# EAGLE design stm32 (EAGLE 9.6.2)
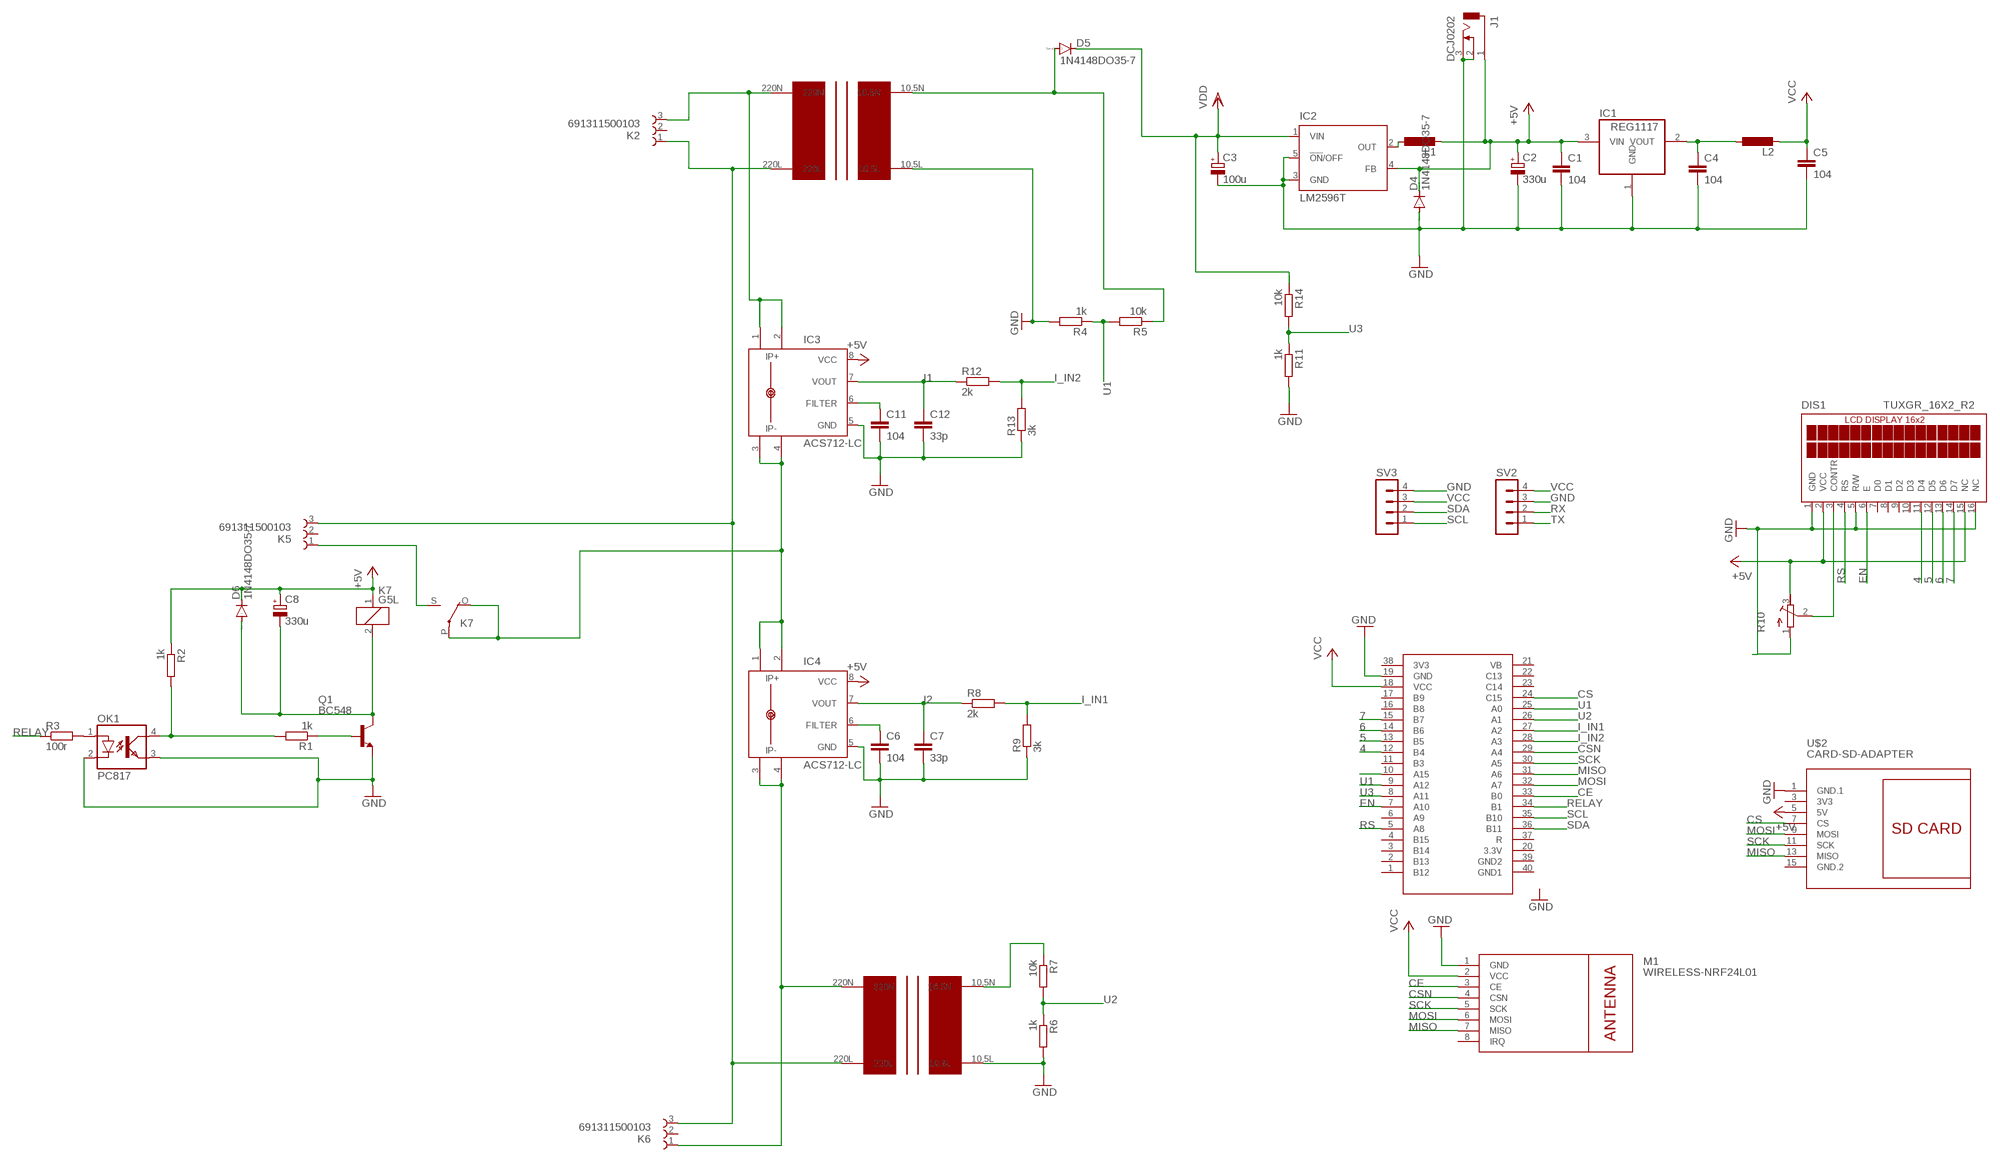
[diagram p0: schematic, sheet 1]

## Parts
C1  104  C-EU050-025X075  [C050-025X075]
C2  330u  CPOL-EUE2.5-7  [E2,5-7]
C3  100u  CPOL-EUE2.5-7  [E2,5-7]
C4  104  C-EU050-025X075  [C050-025X075]
C5  104  C-EU050-025X075  [C050-025X075]
C6  104  C-EU050-025X075  [C050-025X075]
C7  33p  C-EU050-025X075  [C050-025X075]
C8  330u  CPOL-EUE2.5-7  [E2,5-7]
C11  104  C-EU050-025X075  [C050-025X075]
C12  33p  C-EU050-025X075  [C050-025X075]
D4  1N4148DO35-7  [DO35-7]
D5  1N4148DO35-7  [DO35-7]
D6  1N4148DO35-7  [DO35-7]
DIS1  TUXGR_16X2_R2  [TUXGR_16X2_R2]
IC1  REG1117  [SOT223]
IC2  LM2596T  [T05D]
IC3  ACS712-LC  [SOIC8]
IC4  ACS712-LC  [SOIC8]
J1  DCJ0202  [DCJ0202]
K2  691311500103  [691311500103]
K5  691311500103  [691311500103]
K6  691311500103  [691311500103]
K7  G5L  [G5LE]
L1  L-EU6000-XXX-RC  [6000-XXXX-RC]
L2  L-EU6000-XXX-RC  [6000-XXXX-RC]
M1  WIRELESS-NRF24L01  [WIRELESS-NRF24L01]
OK1  PC817  [DIL04]
Q1  BC548  [TO92-EBC]
R1  1k  R-EU_0207/7  [0207/7]
R2  1k  R-EU_0207/7  [0207/7]
R3  100r  R-EU_0207/7  [0207/7]
R4  1k  R-EU_0207/7  [0207/7]
R5  10k  R-EU_0207/7  [0207/7]
R6  1k  R-EU_0207/7  [0207/7]
R7  10k  R-EU_0207/7  [0207/7]
R8  2k  R-EU_0207/7  [0207/7]
R9  3k  R-EU_0207/7  [0207/7]
R10  R-TRIMM3339P  [RTRIM3339P]
R11  1k  R-EU_0207/7  [0207/7]
R12  2k  R-EU_0207/7  [0207/7]
R13  3k  R-EU_0207/7  [0207/7]
R14  10k  R-EU_0207/7  [0207/7]
SV2  MA04-1  [MA04-1]
SV3  MA04-1  [MA04-1]
U$1  KIT_STM32F103  [KIT_STM32F103]
U$2  CARD-SD-ADAPTER  [CARD-SD-ADAPTER]
U$3  BIENAP(10.5)_BIEN_AP  [BIENAP(10.5)_BIEN_AP]
U$4  BIENAP(10.5)_BIEN_AP  [BIENAP(10.5)_BIEN_AP]

## Nets
4: DIS1.11(D4) U$1.12(B4)
5: DIS1.12(D5) U$1.13(B5)
6: DIS1.13(D6) U$1.14(B6)
7: DIS1.14(D7) U$1.15(B7)
+5V: C1.1 C2.+ C8.+ D4.C D6.C DIS1.2(VCC) DIS1.15(NC) IC1.3(VIN) IC2.4(FB) IC3.8(VCC) IC4.8(VCC) J1.1 K7.1 L1.2 R2.1 R10.3(E) U$2.5(5V)
CE: M1.3(CE) U$1.33(B0)
CS: U$1.24(C15) U$2.7(CS)
CSN: M1.4(CSN) U$1.29(A4)
EN: DIS1.6(E) U$1.7(A10)
GND: C1.2 C2.- C3.- C4.2 C5.2 C6.2 C7.2 C11.2 C12.2 D4.A DIS1.1(GND) DIS1.5(R/W) DIS1.16(NC) IC1.1(GND) IC2.3(GND) IC2.5(!ON!/OFF) IC3.5(GND) IC4.5(GND) J1.2 J1.3 M1.1(GND) OK1.2(C) OK1.3(EMIT) Q1.E R4.2 R6.2 R9.1 R10.1(A) R11.2 R13.1 SV2.3 SV3.4 U$1.19(GND) U$2.1(GND.1) U$3.10.5L U$4.10.5L
I1: C12.1 IC3.7(VOUT) R12.1
I2: C7.1 IC4.7(VOUT) R8.1
I_IN1: R8.2 R9.2 U$1.27(A2)
I_IN2: R12.2 R13.2 U$1.28(A3)
MISO: M1.7(MISO) U$1.31(A6) U$2.13(MISO)
MOSI: M1.6(MOSI) U$1.32(A7) U$2.9(MOSI)
N$1: DIS1.3(CONTR) R10.2(S)
N$2: C4.1 IC1.2(VOUT) L2.1
N$3: IC3.1(IP+) IC3.2(IP+1) K2.3 U$3.220N
N$5: D5.A R5.1 U$3.10.5N
N$6: IC3.3(IP-) IC3.4(IP-1) IC4.1(IP+) IC4.2(IP+1) K7.O(2:O) K7.P(2:P)
N$7: C6.1 IC4.6(FILTER)
N$8: IC2.2(OUT) L1.1
N$10: K5.1 K7.S(2:S)
N$11: Q1.B R1.1
N$12: C8.- D6.A K7.2 Q1.C
N$13: OK1.4(COL) R1.2 R2.2
N$14: IC4.3(IP-) IC4.4(IP-1) K6.1 U$4.220N
N$15: OK1.1(A) R3.2
N$16: K2.1 K5.3 K6.3 U$3.220L U$4.220L
N$17: U$1.10(A15)
N$18: R7.1 U$4.10.5N
N$23: C11.1 IC3.6(FILTER)
RELAY: R3.1 U$1.34(B1)
RS: DIS1.4(RS) U$1.5(A8)
RX: SV2.2
SCK: M1.5(SCK) U$1.30(A5) U$2.11(SCK)
SCL: SV3.1 U$1.35(B10)
SDA: SV3.2 U$1.36(B11)
TX: SV2.1
U1: R4.1 R5.2 U$1.9(A12) U$1.25(A0)
U2: R6.1 R7.2 U$1.26(A1)
U3: R11.1 R14.2 U$1.8(A11)
VCC: C5.1 L2.2 M1.2(VCC) SV2.4 SV3.3 U$1.18(VCC)
VDD: C3.+ D5.C IC2.1(VIN) R14.1
Unconnected: DIS1.7(D0) DIS1.8(D1) DIS1.9(D2) DIS1.10(D3) K2.2 K5.2 K6.2 M1.8(IRQ) U$1.1(B12) U$1.2(B13) U$1.3(B14) U$1.4(B15) U$1.6(A9) U$1.11(B3) U$1.16(B8) U$1.17(B9) U$1.20(3.3V) U$1.21(VB) U$1.22(C13) U$1.23(C14) U$1.37(R) U$1.38(3V3) U$1.39(GND2) U$1.40(GND1)

## Power pins joined to a net without a drawn wire
3V3: U$2.3(3V3)
GND.2: U$2.15(GND.2)

## Library data of the parts
C1 C4-C7 C11 C12 = rcl:C-EU: CAPACITOR, European symbol; SPICEPREFIX: C
C2 C3 C8 = rcl:CPOL-EU: POLARIZED CAPACITOR, European symbol; SPICEPREFIX: C
D4-D6 = diode:1N4148: DIODE high speed (Philips)
DIS1 = display-lcd:TUXGR_16X2_R2: Tuxgraphics LCD display 16x2 characters reflective, without background light Source: tuxgr_12x2_r2.pdf; OC_FARNELL: unknown; OC_NEWARK: unknown
IC1 = burr-brown:REG1117: 800mA and 1A Low Dropout (LDO) Positive Regulator 1.8V, 2.5V, 2.85V, 3.3V, 5V, and Adj; MPN: REG1117; OC_FARNELL: 1097566; OC_NEWARK: 14P6981
IC2 = national-semiconductor:LM2596: SIMPLE SWITCHER® Power Converter 150 kHz 3A Step-Down Voltage Regulator Source: http://www.national.com/ds/LM/LM2596.pdf; MPN: LM2596T-ADJ/LF02; OC_FARNELL: 9494162; OC_NEWARK: 65K5910
IC3 IC4 = allegro-2:ACS712-LC
J1 = con-jack:DCJ0202: DC POWER JACK Source: DCJ0202.pdf; OC_FARNELL: unknown; OC_NEWARK: unknown
K2 K5 K6 = Wurth_Elektronik_Electromechanic_Terminal_Blocks_Connectors_rev15c:691311500103: WR-TBL Serie 311 - 5.08 mm Close Vertical PCB Header , 3 Pins=>Code : Con_TBL_Pluggable_5.08_PCB_THT_Simple_V_691311500103 <http://katalog.we-online.de/media/images/eican/Con_TBL_Pluggable_5.08_PCB_THT_Simple_V_6913115001xx_pf2.jpg> Details see: http://katalog.we-online.de/en/em/691_311_500_1xx Created 2014-06-23, Karrer Zheng 2014 (C) Würth Elektronik
K7 = relay:G5L: RELAY 1 x switch, 10 A/120 V AC, 8 A/30 V ADC, Omron; OC_FARNELL: unknown; OC_NEWARK: unknown
L1 L2 = rcl:L-EU: INDUCTOR, European symbol; SPICEPREFIX: L
M1 = diy-modules:WIRELESS-NRF24L01: 2.4 GHz Wireless Module based on NRF24L01 chip More details available here: http://www.electrodragon.com/w/NRF24L01 Click here to find device on ebay.com <http://www.ebay.com/sch/nrf24l01+arduino>
OK1 = optocoupler:PC817: SHARP OPTO COUPLER; MPN: PC817X4J000F; OC_FARNELL: 9707727; OC_NEWARK: 97K7059
Q1 = transistor-npn:BC548*: NPN Transistor
R1-R9 R11-R14 = rcl:R-EU_: RESISTOR, European symbol; SPICEPREFIX: R
R10 = rcl:R-TRIMM: Trimm resistor; SPICEMODEL: X; SPICEPREFIXL: POT
SV2 SV3 = con-lstb:MA04-1: PIN HEADER; OC_FARNELL: unknown; OC_NEWARK: unknown
U$1 = kit stm32:KIT_STM32F103
U$2 = diy-modules:CARD-SD-ADAPTER: Full Size SD Card Adapter Module with onboard 3.3V regulator Guide describing how to use SD card with Arduino is available here: https://www.arduino.cc/en/Reference/SDCardNotes Click here to find device on ebay.com <http://www.ebay.com/sch/sd+card+socket+module>
U$3 U$4 = congsuat:BIENAP(10.5)_BIEN_AP

## Board
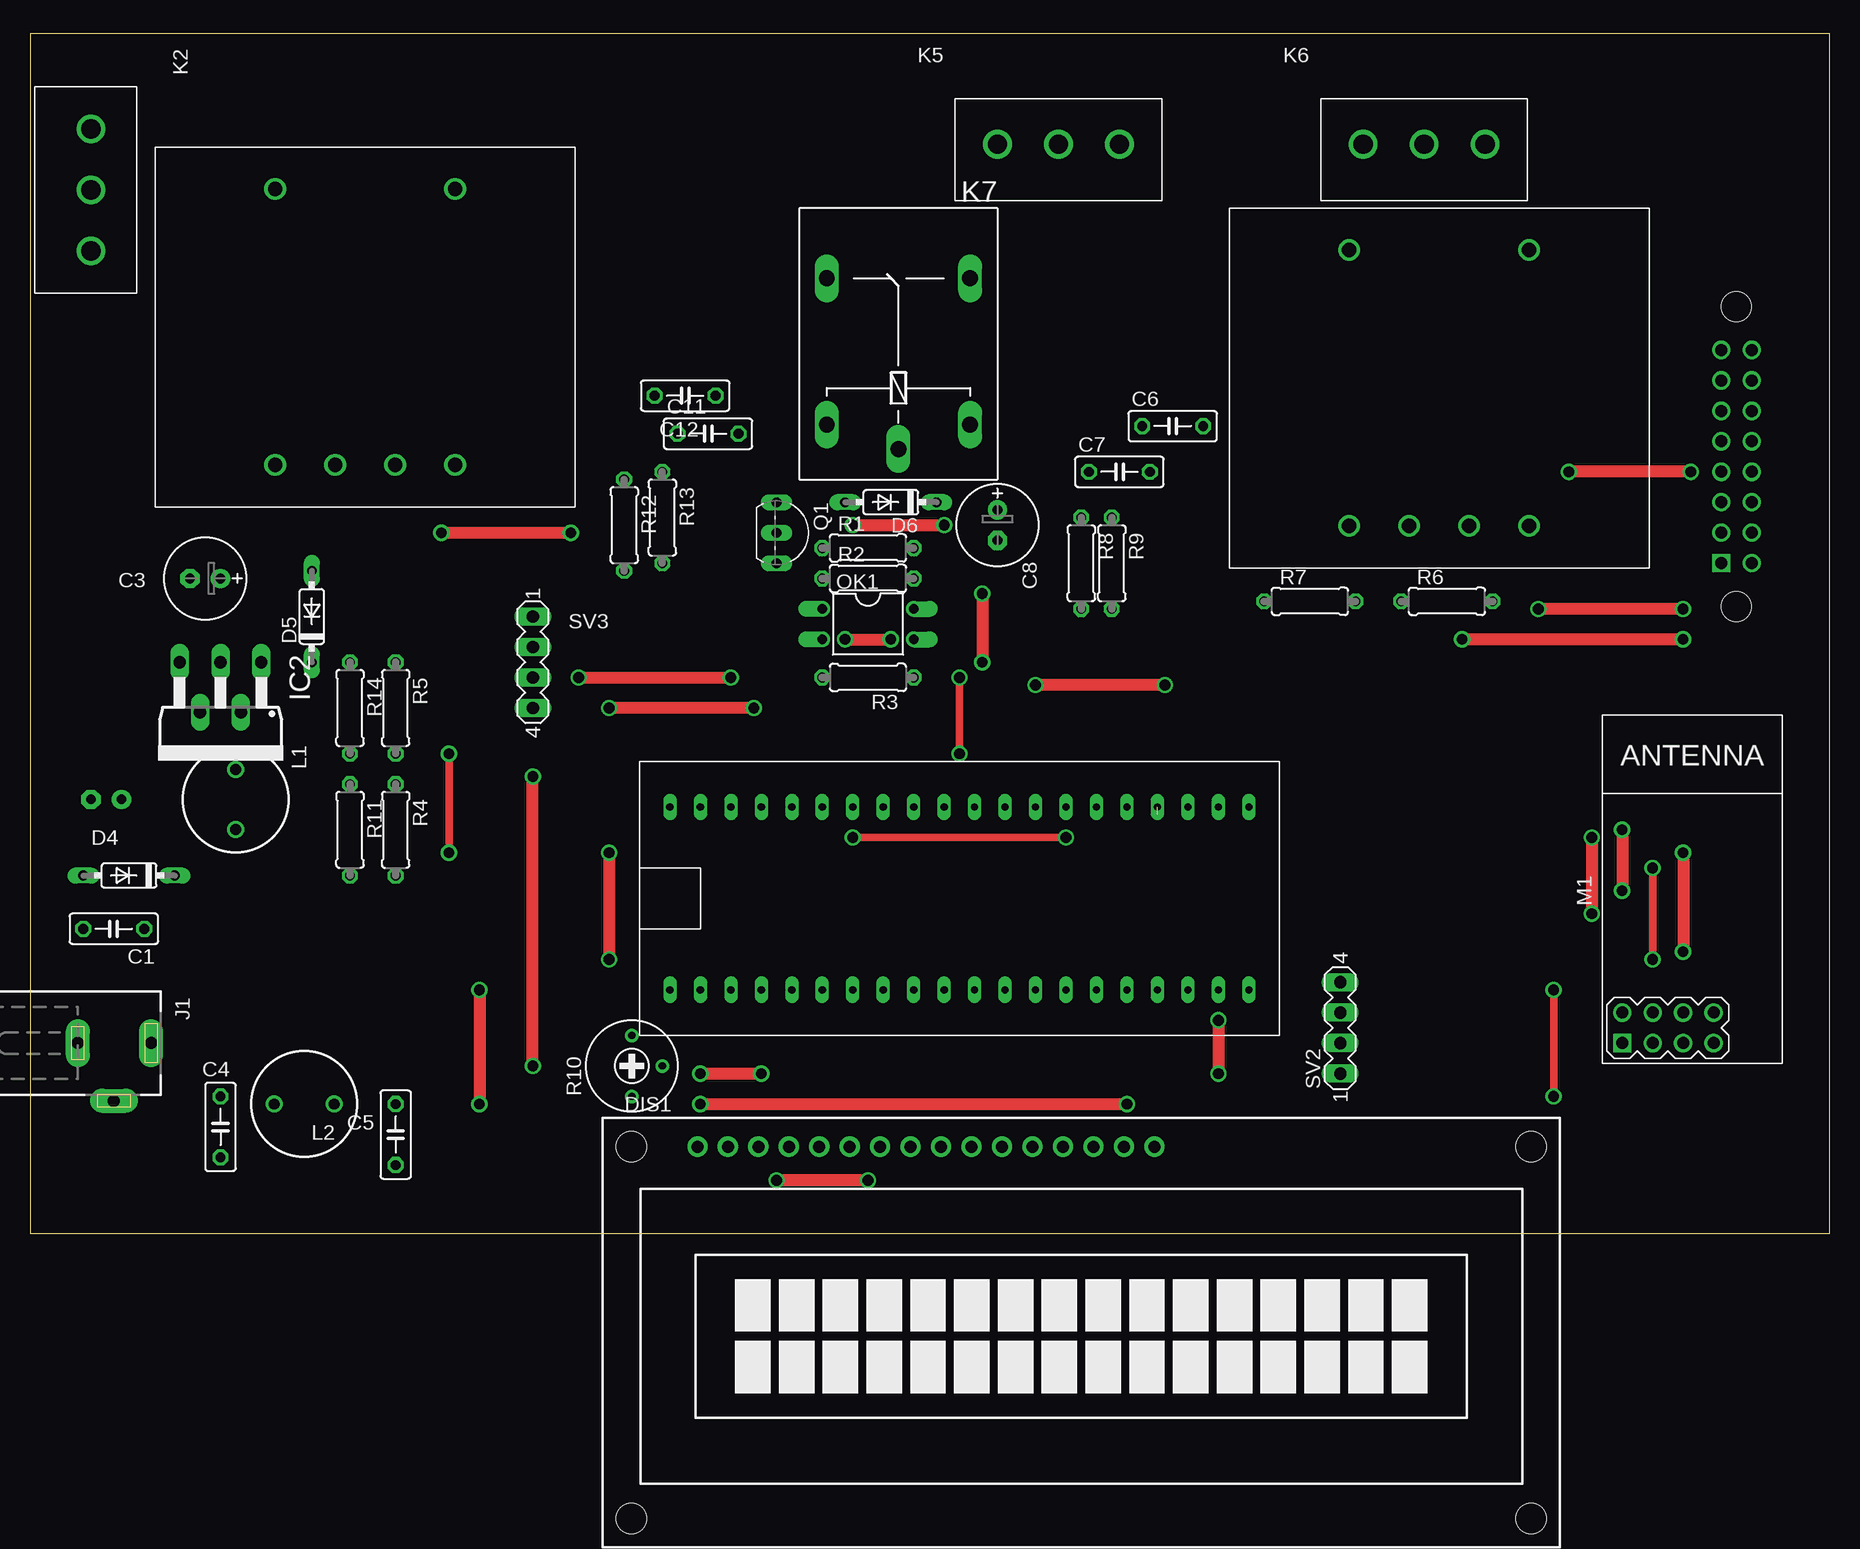
[diagram p1: board, top side]
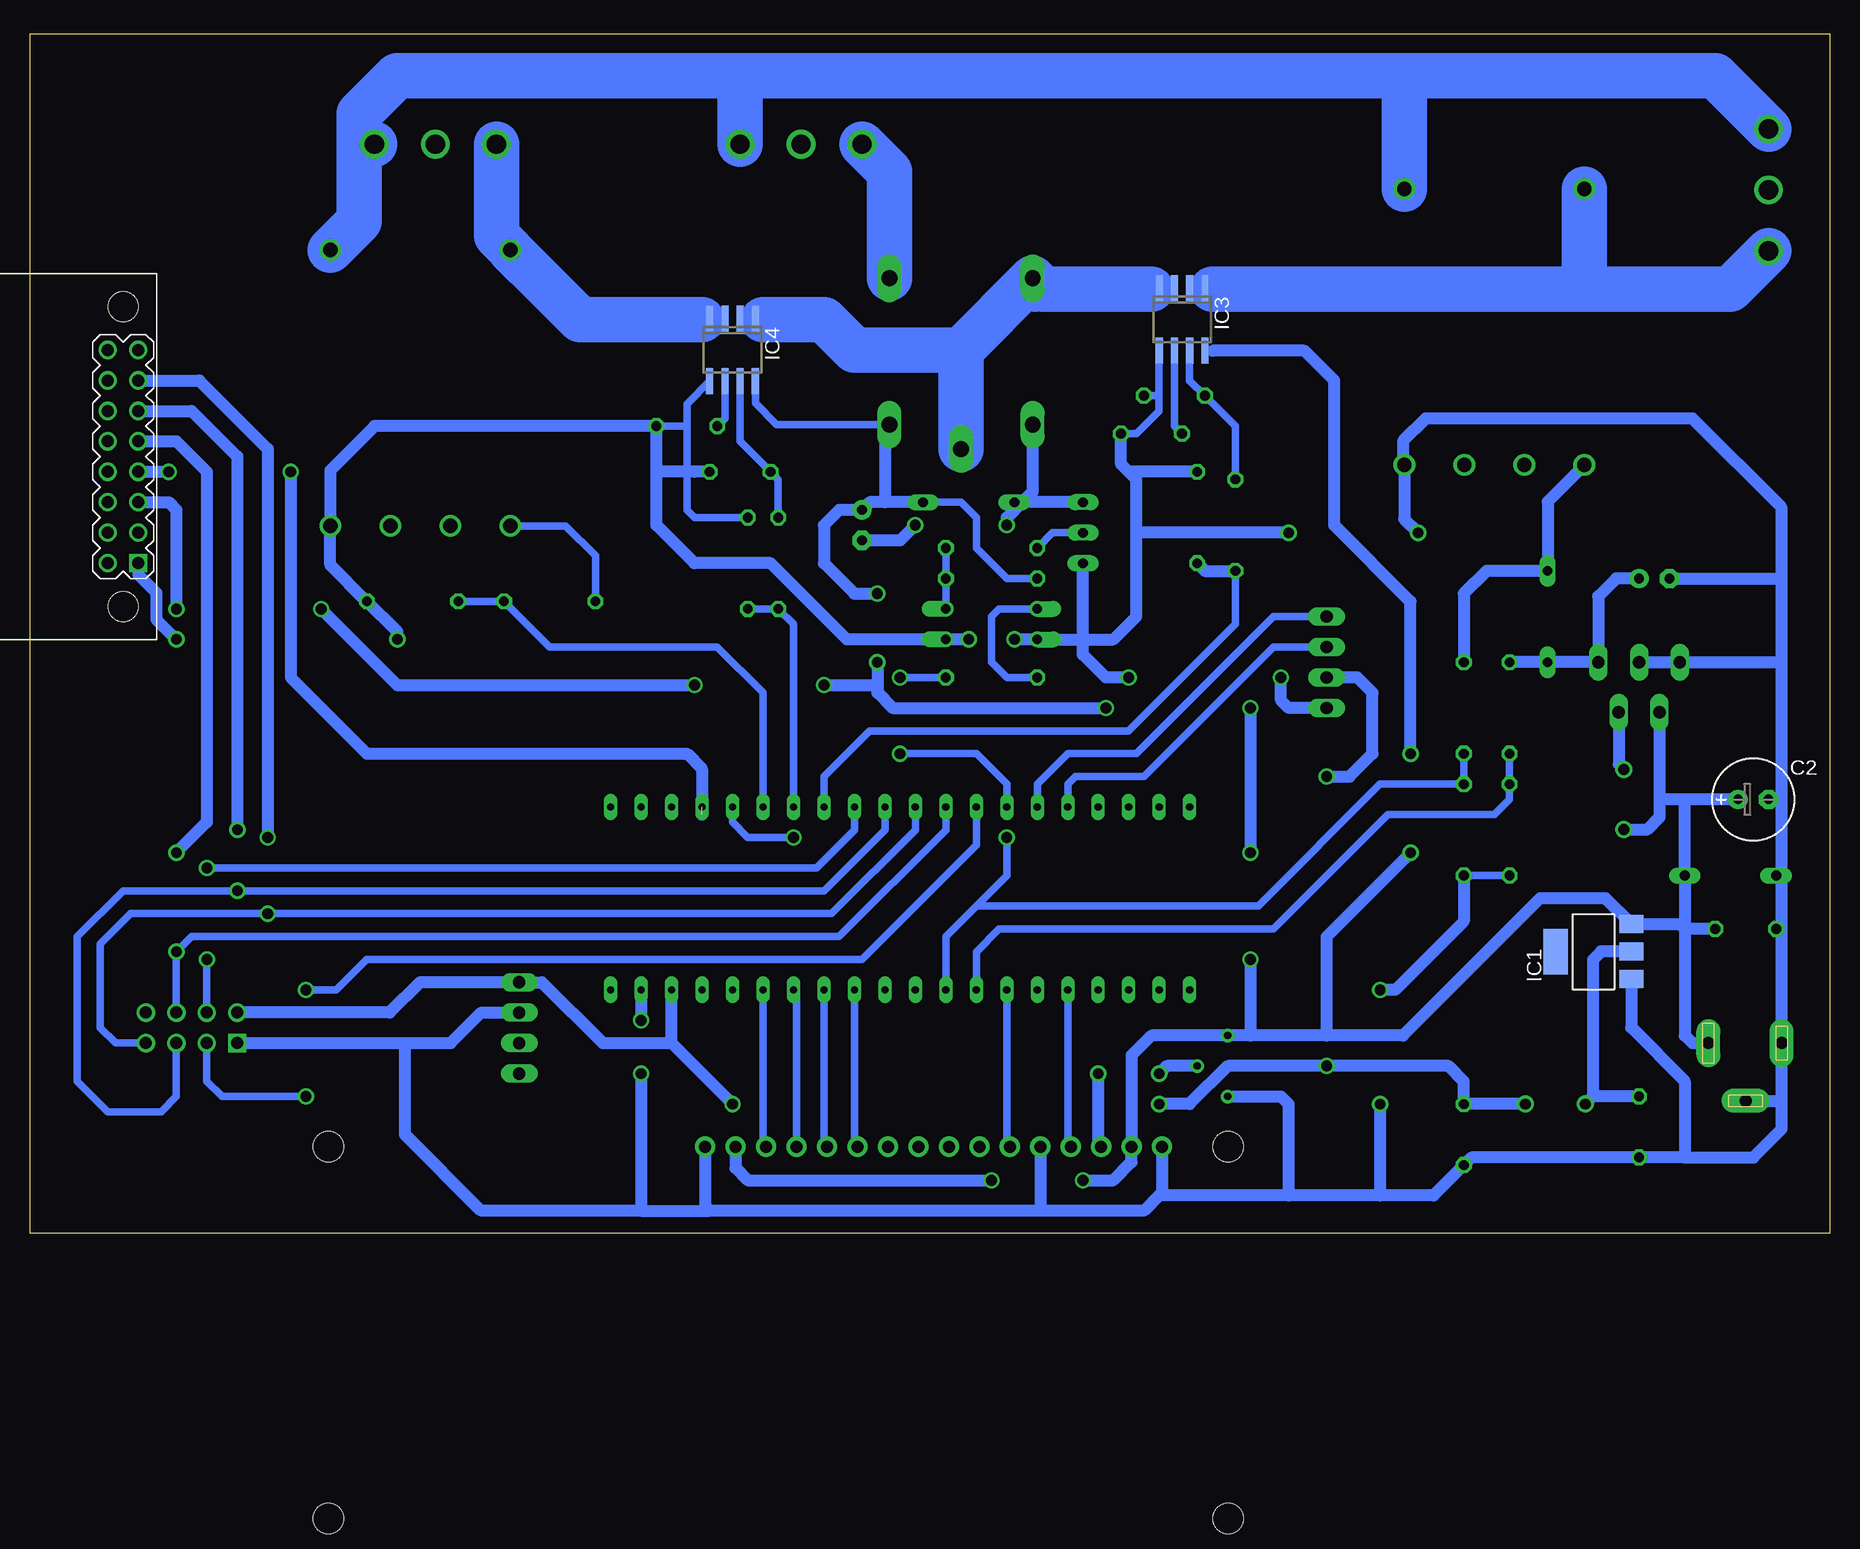
[diagram p2: board, bottom side, seen from below]

Size 150 x 100 mm. Coordinates in mm from the lower left corner, seen from the top.
Outline: 0,0 150,0 150,100 0,100 0,0
Copper layers (1*16): Top 0.035mm / dielectric 1.5mm / Bottom 0.035mm
Design rules "default": minimum track width 6mil, minimum drill 0.35mm, track to track 6mil, track to pad 6mil, pad to pad 6mil, via to via 6mil, smd to smd 6mil, copper to edge 40mil, drill to drill 6mil, minimum pad ring 10mil, minimum via ring 8mil, stop-mask expansion 4mil, vias tented up to drill 0mil, thermal gap 10mil

### Footprints (pad centres in the part's own frame; a part is rotated, then mirrored left to right if it is on the bottom)
C050-025X075 = drill 0.813 octagon: 1 -2.54,0; 2 2.54,0
E2,5-7 = drill 0.813 pad 1.6: + -1.27,0 | drill 0.813 pad 1.6 octagon: - 1.27,0
DO35-7 = drill 0.813 long: A 3.81,0; C -3.81,0
TUXGR_16X2_R2 = drill 1 pad 1.676: 1 -32,15.5; 2 -29.46,15.5; 3 -26.92,15.5; 4 -24.38,15.5; 5 -21.84,15.5; 6 -19.3,15.5; 7 -16.76,15.5; 8 -14.22,15.5; 9 -11.68,15.5; 10 -9.14,15.5; 11 -6.6,15.5; 12 -4.06,15.5; 13 -1.52,15.5; 14 1.02,15.5; 15 3.56,15.5; 16 6.1,15.5 | hole 2.5: -37.5,-15.5; 37.5,-15.5; -37.5,15.5; 37.5,15.5
SOT223 = smd 1.499 x 2.007: 1 -2.261,-3.15; 2 0.025,-3.15; 3 2.311,-3.15 | smd 3.81 x 2.007: 4 0,3.15
T05D = drill 1.016 long: 1 -3.404,-5.08; 2 -1.702,-0.914; 3 0,-5.08; 4 1.702,-0.914; 5 3.404,-5.08
SOIC8 = smd 0.6 x 2.2: 1 -1.905,-2.6; 2 -0.635,-2.6; 3 0.635,-2.6; 4 1.905,-2.6; 5 1.905,2.6; 6 0.635,2.6; 7 -0.635,2.6; 8 -1.905,2.6
DCJ0202 = drill 1 pad 2 long: 1 0,3.1; 2 4.8,0; 3 0,-3
691311500103 = drill 1.6: 1 -5.08,0; 2 0,0; 3 5.08,0
G5LE = drill 1.321 long: 1 -7.493,-5.969; 2 -7.493,5.969; O 4.699,5.969; P -9.525,0; S 4.699,-5.969
6000-XXXX-RC = drill 0.9 pad 1.422: 1 -2.5,0; 2 2.5,0
WIRELESS-NRF24L01 = drill 1 square: 1 -12.7,6.35 | drill 1: 2 -10.16,6.35; 3 -12.7,3.81; 4 -10.16,3.81; 5 -12.7,1.27; 6 -10.16,1.27; 7 -12.7,-1.27; 8 -10.16,-1.27
DIL04 = drill 0.813 offset: 1 -1.27,-3.81; 2 1.27,-3.81; 3 1.27,3.81; 4 -1.27,3.81
TO92-EBC = drill 0.813 long: B 0,-1.27; C -2.54,-1.27; E 2.54,-1.27
0207/7 = drill 0.813 octagon: 1 -3.81,0; 2 3.81,0
RTRIM3339P = drill 0.61: 1 -2.54,0; 2 0,-2.54; 3 2.54,0
MA04-1 = drill 1.016 long: 1 -3.81,0; 2 -1.27,0; 3 1.27,0; 4 3.81,0
KIT_STM32F103 = drill 0.6 long: 1 -24.13,-7.62; 2 -21.59,-7.62; 3 -19.05,-7.62; 4 -16.51,-7.62; 5 -13.97,-7.62; 6 -11.43,-7.62; 7 -8.89,-7.62; 8 -6.35,-7.62; 9 -3.81,-7.62; 10 -1.27,-7.62; 11 1.27,-7.62; 12 3.81,-7.62; 13 6.35,-7.62; 14 8.89,-7.62; 15 11.43,-7.62; 16 13.97,-7.62; 17 16.51,-7.62; 18 19.05,-7.62; 19 21.59,-7.62; 20 24.13,-7.62; 21 24.13,7.62; 22 21.59,7.62; 23 19.05,7.62; 24 16.51,7.62; 25 13.97,7.62; 26 11.43,7.62; 27 8.89,7.62; 28 6.35,7.62; 29 3.81,7.62; 30 1.27,7.62; 31 -1.27,7.62; 32 -3.81,7.62; 33 -6.35,7.62; 34 -8.89,7.62; 35 -11.43,7.62; 36 -13.97,7.62; 37 -16.51,7.62; 38 -19.05,7.62; 39 -21.59,7.62; 40 -24.13,7.62
CARD-SD-ADAPTER = drill 1 square: 1 -21.59,8.89 | drill 1: 2 -19.05,8.89; 3 -21.59,6.35; 4 -19.05,6.35; 5 -21.59,3.81; 6 -19.05,3.81; 7 -21.59,1.27; 8 -19.05,1.27; 9 -21.59,-1.27; 10 -19.05,-1.27; 11 -21.59,-3.81; 12 -19.05,-3.81; 13 -21.59,-6.35; 14 -19.05,-6.35; 15 -21.59,-8.89; 16 -19.05,-8.89 | hole 2.5: -20.32,12.5; -20.32,-12.5
BIENAP(10.5)_BIEN_AP = drill 1.2: 10.5L 7.5,-11.5; 10.5N -7.5,-11.5; 220L 7.5,11.5; 220N -7.5,11.5; P$4 -2.5,-11.5; P$5 2.5,-11.5

### Placement (x,y rotation side)
C1  6.99,25.4 180 top
C2  6.35,36.2 0 bottom
C3  14.61,54.61 180 top
C4  15.88,8.89 270 top
C5  30.48,8.26 270 top
C6  95.25,67.31 0 top
C7  90.81,63.5 0 top
C8  80.64,59.05 270 top
C11  56.52,66.67 0 top
C12  54.61,69.85 0 top
D4  8.26,29.84 180 top
D5  23.5,51.44 90 top
D6  71.75,60.96 180 top
DIS1  87.63,-8.26 0 top
IC1  19.68,23.5 90 bottom
IC2  15.88,42.55 180 top
IC3  53.98,76.2 180 bottom
IC4  91.44,73.66 180 bottom
J1  6.99,15.88 270 top
K2  5.08,87 270 top
K5  85.72,90.81 0 top
K6  116.2,90.81 0 top
K7  72.39,74.93 90 top
L1  17.14,36.2 270 top
L2  22.86,10.79 0 top
M1  139.06,28.57 90 top
OK1  69.85,50.8 270 top
Q1  63.5,58.42 270 top
R1  69.85,57.15 0 top
R2  69.85,54.61 0 top
R3  69.85,46.35 180 top
R4  30.48,33.66 270 top
R5  30.48,43.81 270 top
R6  118.11,52.7 0 top
R7  106.68,52.7 0 top
R8  87.63,55.88 270 top
R9  90.17,55.88 270 top
R10  50.16,13.97 90 top
R11  26.67,33.66 270 top
R12  49.53,59.05 270 top
R13  52.7,59.69 270 top
R14  26.67,43.81 270 top
SV2  109.22,17.14 90 top
SV3  41.91,47.62 270 top
U$1  77.47,27.94 0 top
U$2  162.56,64.77 180 bottom
U$3  27.94,75.56 0 top
U$4  117.47,70.48 0 top

### Tracks (layer width: path | path; a pad name or v marks a point on that pad's centre or on a via)
4
  Bottom 0.61: U$1.12 81.28,7.5 DIS1.11
5
  Bottom 0.61: U$1.13 83.82,7.5 DIS1.12
6
  Bottom 0.61: U$1.14 86.11,20.07 DIS1.13
7
  Bottom 0.61: U$1.15 88.9,7.5 DIS1.14
+5V  (via drill 0.9)
  Top 0.61: v34.92,40.01 v34.92,31.75
  Top 1.016: v79.38,53.34 v79.38,47.62 | v60.33,43.81 v48.26,43.81 | v48.26,31.75 v48.26,22.86 | v69.85,4.45 v62.23,4.45 | v137.79,52.07 v125.73,52.07 | v94.61,45.72 v83.82,45.72
  Bottom 0.61: K7.1 87.76,67.44 89.53,69.22 IC4.8 | R2.1 68.58,54.61 71.12,57.15 71.12,59.69 72.39,60.96 76.2,60.96 | IC3.8 51.44,73.6 | v34.92,31.75 35.24,31.43
  Bottom 1.016: IC2.4 14.17,36.2 | 14.17,36.2 14.17,34.72 15.24,33.66 17.11,33.66 L1.2 | C2.+ 12.06,36.2 | 12.06,36.2 14.17,36.2 | 12.06,36.2 D4.C 12.06,25.4 | 12.06,25.4 12.06,16.51 11.43,15.88 J1.1 | C1.1 12.06,25.4 | 12.06,25.4 12.47,25.81 IC1.3 18.67,27.94 24.13,27.94 35.56,16.51 41.91,16.51 | D6.C 76.2,60.96 78.74,60.96 | 78.74,60.96 80.01,60.96 C8.+ 82.55,60.33 83.82,59.05 83.82,55.88 81.28,53.34 v79.38,53.34 | K7.1 78.74,67.06 78.74,60.96 | 41.91,16.51 48.26,16.51 | 48.26,16.51 R10.3 56.52,16.51 58.17,14.86 DIS1.2 58.17,5.96 59.69,4.45 v62.23,4.45 | v79.38,47.62 79.38,45.72 | 79.38,45.72 79.38,45.09 78.11,43.81 v60.33,43.81 | v48.26,43.81 v48.26,31.75 | v48.26,22.86 48.26,16.51 | 41.91,16.51 41.91,24.77 35.24,31.43 | v34.92,40.01 34.92,52.7 41.27,59.05 41.27,71.12 43.76,73.6 51.44,73.6 | DIS1.15 91.19,5.46 90.17,4.45 v69.85,4.45 | U$2.5 138.43,60.96 137.79,60.33 v137.79,52.07 | v125.73,52.07 119.38,45.72 v94.61,45.72 | v83.82,45.72 79.38,45.72
CE  (via drill 0.9)
  Top 0.61: v127,20.32 v127,11.43
  Bottom 0.61: U$1.33 71.12,32.38 80.64,22.86 121.92,22.86 124.46,20.32 v127,20.32 | v127,11.43 133.99,11.43 135.25,12.7 M1.3
CS  (via drill 0.9)  (1 unrouted)
  Top 1.016: v138.43,63.5 v128.27,63.5
  Bottom 1.016: U$2.7 v138.43,63.5 | v128.27,63.5 128.27,46.35 124.46,42.55 121.92,40.01 95.25,40.01 93.98,38.73 93.98,34.92
CSN  (via drill 0.9)
  Top 0.61: v135.25,30.48 v135.25,22.86
  Bottom 0.61: U$1.29 81.28,33.66 81.92,33.02 84.45,30.48 v135.25,30.48 | v135.25,22.86 M1.4
EN
  Bottom 0.61: U$1.7 68.58,7.5 DIS1.6
GND  (via drill 0.9)
  Top 1.016: v37.47,20.32 v37.47,10.79 | v45.72,46.35 v58.42,46.35 | v34.29,58.42 v45.09,58.42 | v67.94,49.53 v71.75,49.53 | v99.06,17.78 v99.06,13.34 | v137.79,49.53 v119.38,49.53
  Bottom 0.61: R9.1 94.61,59.69 95.25,60.33 95.25,63.5 | IC4.5 95.25,69.16 95.25,67.31 | 95.25,67.31 95.25,63.5 | C6.2 95.25,67.31 | 95.25,63.5 94.61,63.5 | R13.1 55.88,63.5 | 57.78,61.59 57.78,58.42 | IC3.5 55.88,69.85 | 55.88,69.85 55.88,68.58 57.78,66.67 C11.2 | C12.2 55.88,69.85 | R4.2 R11.2
  Bottom 1.016: 3.98,25.4 J1.3 3.98,10.79 | 3.98,25.4 3.98,29.84 | 3.98,29.84 3.98,36.2 | 3.98,36.2 3.98,47.62 | 3.98,47.62 3.98,54.61 | 3.98,54.61 3.98,60.5 11.43,67.94 33.66,67.94 35.56,66.04 35.56,64.19 U$3.10.5L 35.44,59.57 v34.29,58.42 | C3.- 3.98,54.61 | 3.98,47.62 IC2.5 IC2.3 | C2.- 3.98,36.2 | D4.A 3.98,29.84 | C1.2 3.98,25.4 | IC1.1 16.54,17.17 12.06,12.7 12.06,6.35 | 12.06,6.35 C4.2 29.84,6.35 C5.2 33.02,3.17 37.47,3.17 | 12.06,6.35 6.35,6.35 3.98,8.71 3.98,10.79 | J1.2 4.26,11.07 3.98,10.79 | 37.47,3.17 45.09,3.17 | 45.09,3.17 55.88,3.17 | 66.04,1.91 57.15,1.91 55.88,3.17 | 66.04,1.91 93.34,1.91 | DIS1.5 65.79,2.15 66.04,1.91 | DIS1.1 55.63,3.42 55.88,3.17 | R10.1 45.72,11.43 45.09,10.79 45.09,3.17 | R4.2 30.48,26.04 36.2,20.32 v37.47,20.32 | v37.47,10.79 37.47,3.17 | SV3.4 45.09,43.81 45.72,44.45 v45.72,46.35 | v58.42,46.35 60.33,46.35 62.23,48.26 62.23,49.53 | 62.23,49.53 Q1.E | 62.23,49.53 OK1.2 v67.94,49.53 | 62.23,49.53 59.69,49.53 57.78,51.44 57.78,58.42 | 57.78,58.42 57.78,62.87 58.42,63.5 | 58.42,63.5 59.05,64.14 C11.2 | R13.1 58.42,63.5 | v45.09,58.42 57.78,58.42 | v71.75,49.53 OK1.3 81.92,49.53 88.27,55.88 94.61,55.88 97.79,59.05 97.79,63.5 | 97.79,63.5 C6.2 121.28,67.31 124.97,63.62 U$4.10.5L 124.97,55.76 R6.2 119.38,50.16 v119.38,49.53 | C7.2 94.61,63.5 97.79,63.5 | M1.1 118.75,15.88 | 118.75,15.88 114.94,15.88 112.39,18.41 SV2.3 | U$1.19 v99.06,17.78 | 99.06,1.91 93.34,1.91 | DIS1.16 93.73,2.29 93.34,1.91 | 99.06,1.91 112.39,1.91 118.75,8.26 118.75,15.88 | v99.06,13.34 99.06,1.91 | U$2.1 140.97,54.92 139.47,53.42 139.47,51.2 v137.79,49.53
I1
  Bottom 0.61: IC3.7 53.34,71.12 C12.1 49.53,67.31 R12.1
I2
  Bottom 0.61: IC4.7 90.81,66.04 C7.1 87.63,62.87 R8.1
I_IN1
  Bottom 0.61: R9.2 R8.2 86.36,50.8 U$1.27
I_IN2
  Bottom 0.61: R12.2 49.53,50.8 58.42,41.91 80.01,41.91 83.82,38.1 U$1.28
  Bottom 1.016: R13.2 52.07,55.24 R12.2
MISO  (via drill 0.9)
  Top 1.016: v130.18,33.02 v130.18,26.67
  Bottom 0.61: U$1.31 76.2,33.66 83.19,26.67 v130.18,26.67 141.6,26.67 144.15,24.13 144.15,17.14 142.88,15.88 M1.7
  Bottom 1.016: U$2.13 135.89,71.12 130.18,65.41 v130.18,33.02
MOSI  (via drill 0.9)
  Top 1.016: v137.79,31.75 v137.79,23.5
  Bottom 0.61: M1.6 v137.79,23.5 136.53,24.77 82.55,24.77 73.66,33.66 U$1.32
  Bottom 1.016: U$2.9 137.79,66.04 135.25,63.5 135.25,34.29 v137.79,31.75
N$1  (via drill 0.9)
  Top 1.016: v55.88,13.34 v60.96,13.34
  Bottom 1.016: R10.2 55.24,13.97 v55.88,13.34 | v60.96,13.34 60.96,7.5 DIS1.3
N$2
  Bottom 1.016: C4.1 19.73,11.43 | 19.73,11.43 L2.1 | IC1.2 19.02,23.52 19.73,22.82 19.73,11.43
N$3
  Bottom 0.254: 51.44,78.74 52.01,78.74 IC3.1 IC3.2
  Bottom 3.81: U$3.220N 20.44,79.38 19.8,78.74 | K2.3 8.26,78.74 19.8,78.74 | 19.8,78.74 51.44,78.74
N$5
  Bottom 1.016: U$3.10.5N 23.5,61.01 D5.A 28.57,55.24 30.48,53.34 R5.1
N$6
  Bottom 0.254: IC4.2 IC4.1 89.47,76.2 88.9,76.2 | 56.52,78.74 55.94,78.74 | 55.94,78.74 IC3.4 | 55.94,78.74 54.67,78.74 IC3.3
  Bottom 3.81: K7.O 66.42,78.99 66.17,78.74 | K7.O 72.39,73.66 | 72.39,73.66 K7.P | 72.39,73.66 81.28,73.66 83.82,76.2 88.9,76.2 | K7.O 65.53,78.74 56.52,78.74
N$7
  Bottom 0.61: IC4.6 92.08,67.94 C6.1
N$8
  Bottom 1.016: IC2.2 17.58,39.13 L1.1
N$10
  Bottom 3.81: K5.1 78.36,88.52 K7.S
N$11
  Bottom 0.61: Q1.B 64.77,58.42 R1.1
N$12  (via drill 0.9)
  Top 1.016: v68.58,59.05 v76.2,59.05
  Bottom 1.016: K7.2 66.42,61.85 67.31,60.96 | 67.31,60.96 D6.A | Q1.C 67.31,60.96 | 67.31,60.96 68.58,59.69 v68.58,59.05 | v76.2,59.05 77.47,57.78 C8.-
N$13
  Bottom 0.61: R1.2 R2.2 OK1.4
N$14
  Bottom 0.254: IC4.3 IC4.4 93.41,76.2 93.98,76.2
  Bottom 3.81: K6.1 111.12,83.19 108.58,80.64 | 93.98,76.2 104.14,76.2 108.58,80.64 | U$4.220N 108.64,80.64 108.58,80.64
N$15
  Bottom 0.61: OK1.1 69.22,52.07 69.85,51.44 69.85,47.62 68.58,46.35 R3.2
N$16
  Bottom 3.81: K2.1 9.53,96.52 35.56,96.52 | 122.56,90.81 122.56,93.34 119.38,96.52 90.81,96.52 | 122.56,90.81 122.56,84.41 U$4.220L | 35.56,96.52 90.81,96.52 | K6.3 122.56,90.81 | K5.3 90.81,96.52 | U$3.220L 35.44,96.4 35.56,96.52
N$18
  Bottom 0.61: U$4.10.5N 105.34,58.98 102.87,56.52 R7.1
N$23
  Bottom 0.61: IC3.6 54.61,67.31 C11.1
RELAY  (via drill 0.9)
  Top 0.61: v77.47,40.01 v77.47,46.35
  Bottom 0.61: U$1.34 68.58,37.47 71.12,40.01 v77.47,40.01 | v77.47,46.35 R3.1
RS
  Bottom 0.61: U$1.5 63.5,7.5 DIS1.4
SCK  (via drill 0.9)
  Top 1.016: v132.72,33.66 v132.72,28.57
  Bottom 0.61: U$1.30 78.74,33.66 83.82,28.57 v132.72,28.57 142.24,28.57 146.05,24.77 146.05,12.7 143.51,10.16 139.06,10.16 137.79,11.43 M1.5
  Bottom 1.016: U$2.11 136.53,68.58 132.72,64.77 v132.72,33.66
SCL
  Bottom 0.61: SV3.1 46.35,51.44 57.78,40.01 63.5,40.01 66.04,37.47 U$1.35
SDA
  Bottom 0.61: U$1.36 63.5,37.47 62.87,38.1 57.15,38.1 46.35,48.9 SV3.2
U1  (via drill 0.9)
  Top 0.61: v68.58,33.02 v86.36,33.02
  Bottom 0.61: R5.2 R4.1 37.47,37.47 47.62,27.3 71.12,27.3 | 71.12,27.3 73.03,25.4 73.66,24.77 U$1.9 | 71.12,27.3 68.58,29.84 v68.58,33.02 | v86.36,33.02 90.17,33.02 91.44,34.29 U$1.25
U2
  Bottom 0.61: U$1.26 88.9,45.09 92.71,48.9 106.68,48.9 R7.2 R6.1
U3
  Bottom 0.61: R14.2 R11.1 26.67,36.2 27.94,34.92 36.83,34.92 46.35,25.4 69.22,25.4 71.12,23.5 U$1.8
VCC  (via drill 0.9)
  Top 1.016: v41.91,13.97 v41.91,38.1 | v55.88,10.79 v91.44,10.79
  Bottom 1.016: L2.2 C5.1 30.48,12.7 31.75,13.97 v41.91,13.97 50.16,13.97 53.34,10.79 v55.88,10.79 | v41.91,38.1 40.01,38.1 38.1,40.01 38.1,45.09 39.37,46.35 SV3.3 | v91.44,10.79 96.52,15.88 | 96.52,15.88 U$1.18 | 96.52,15.88 102.23,15.88 107.31,20.95 SV2.4 117.47,20.95 120.02,18.41 M1.2
VDD
  Bottom 1.016: C3.+ 17.78,54.61 19.28,53.11 IC2.1 D5.C R14.1